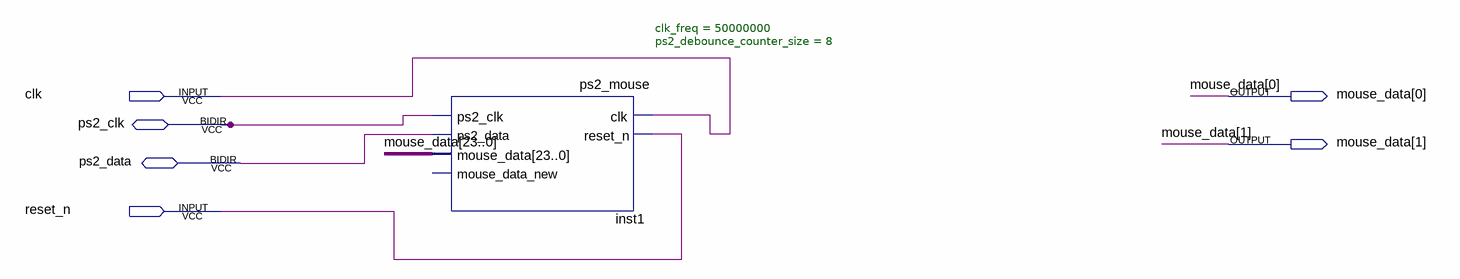
[diagram p0: schematic sheet]
// Quartus schematic mouse.bdf as structural Verilog: 1 symbols, 6 pins
module mouse (
  input  clk,
  input  reset_n,
  inout  ps2_clk,
  inout  ps2_data,
  output [23:0] mouse_data
);

  ps2_mouse #(.clk_freq(50000000), .ps2_debounce_counter_size(8)) inst1 (
    .clk(clk), .reset_n(reset_n), .mouse_data(mouse_data), .ps2_clk(ps2_clk), .ps2_data(ps2_data));  // open: mouse_data_new
endmodule
